# EAGLE design muralizer_3_1 (EAGLE 5.10)
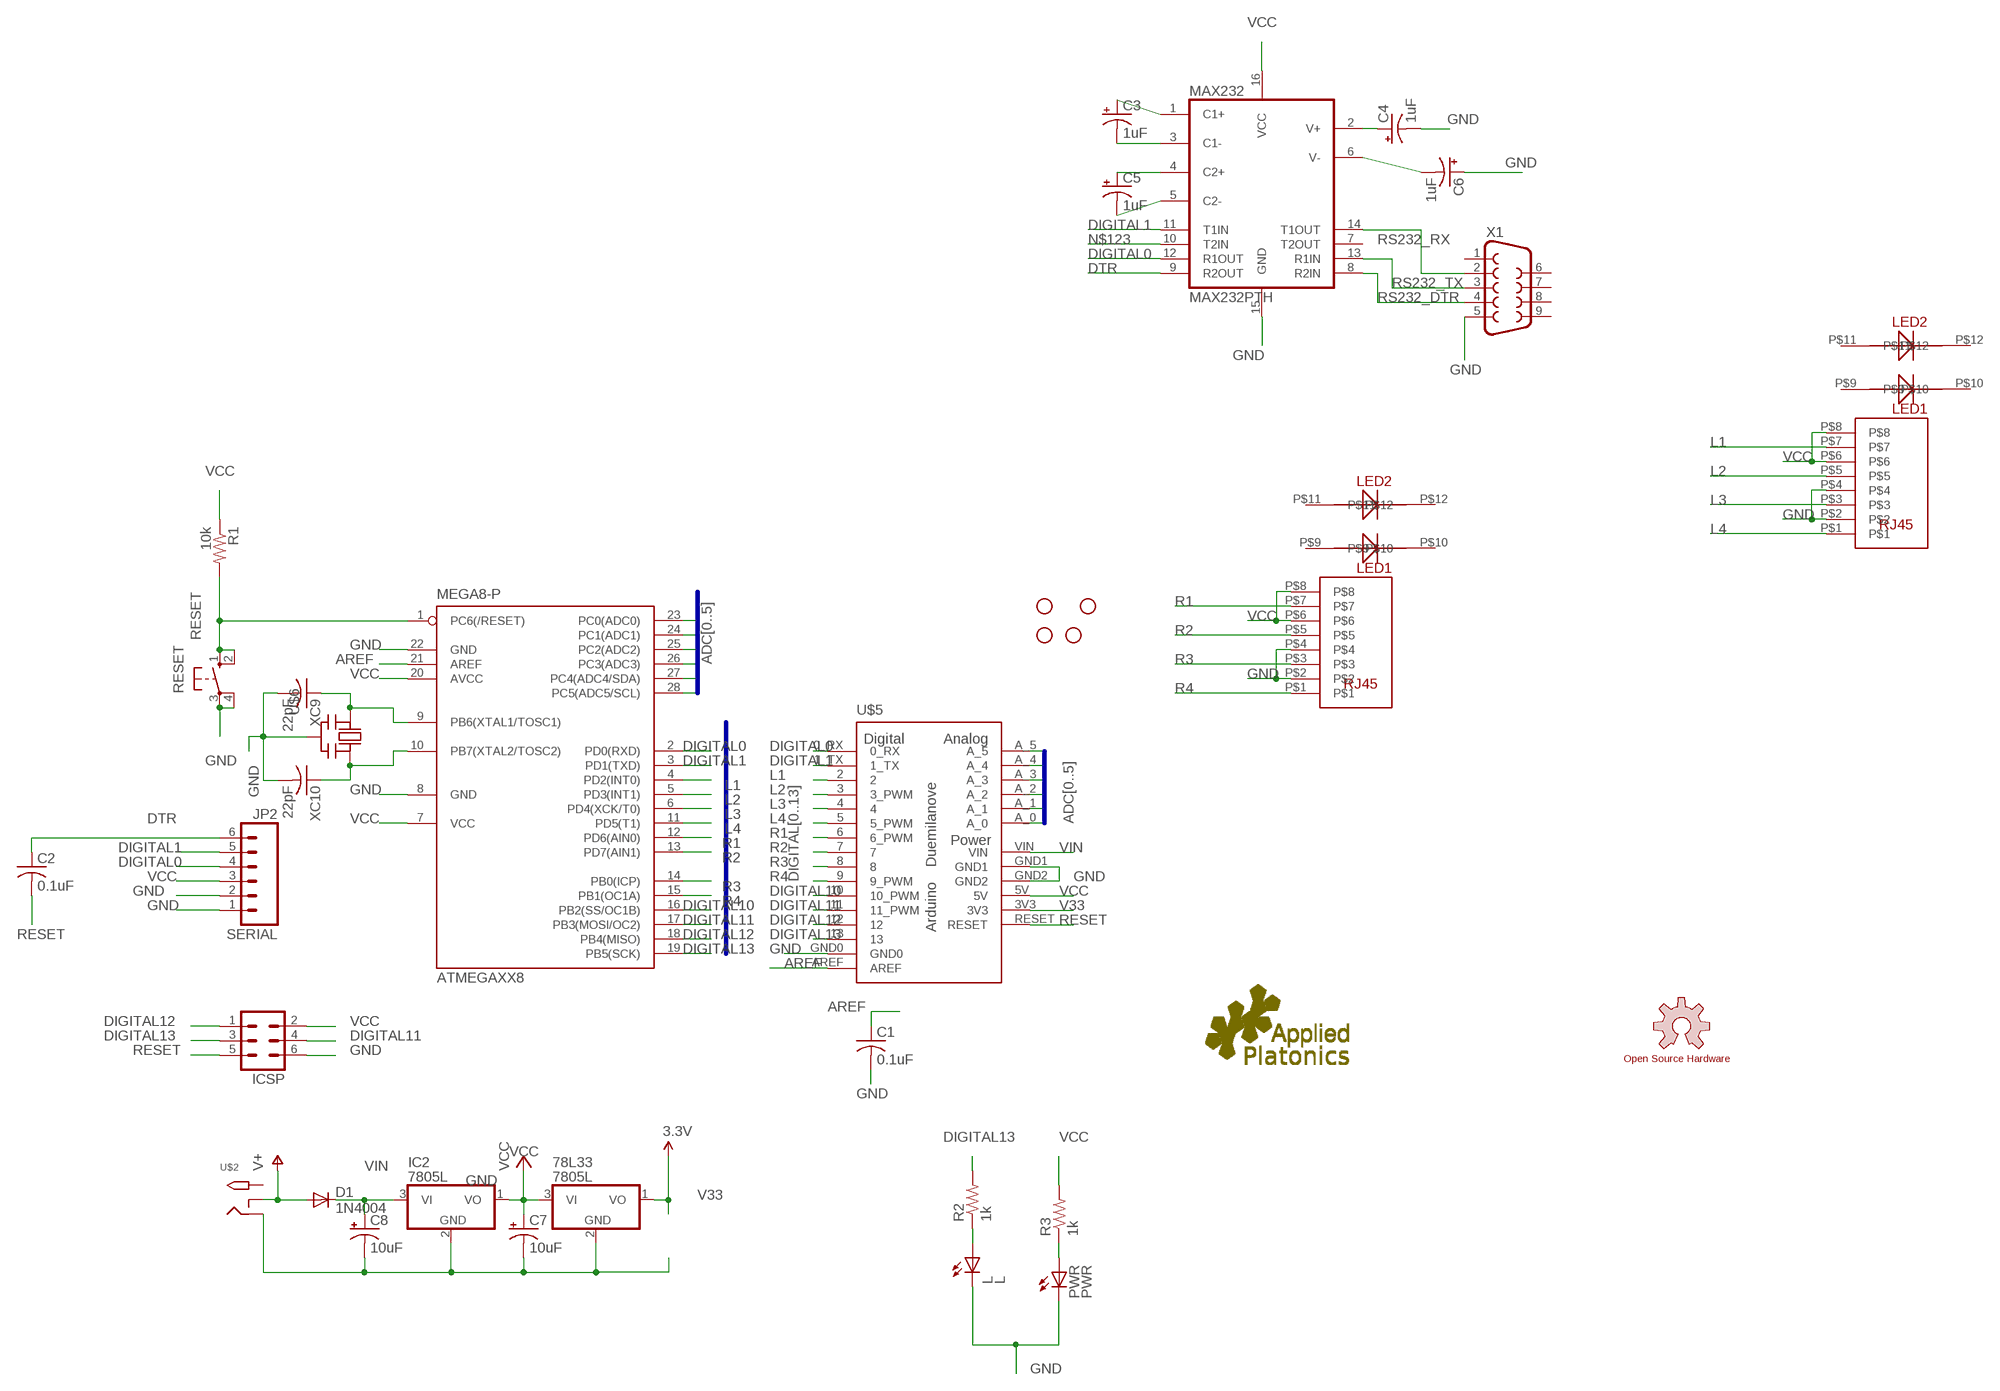
[diagram p0: schematic, sheet 1]

## Parts
78L33  7805L  [TO92]
ATMEGAXX8  MEGA8-P  [DIL28-3]
C1  0.1uF  C-US025-024X044  [C025-024X044]
C2  0.1uF  C-US025-024X044  [C025-024X044]
C3  1uF  CPOL-USE2.5-6  [E2,5-6]
C4  1uF  CPOL-USE2.5-6  [E2,5-6]
C5  1uF  CPOL-USE2.5-6  [E2,5-6]
C6  1uF  CPOL-USE2.5-6  [E2,5-6]
C7  10uF  CPOL-USE2.5-6  [E2,5-6]
C8  10uF  CPOL-USE2.5-6  [E2,5-6]
D1  1N4004  [DO41-10]
IC2  7805L  [TO92]
ICSP  MA03-2  [MA03-2]
JP1  STAND-OFF  [STAND-OFF]
JP2  SERIAL  M06RA  [MOLEX-1X6-RA]
JP3  STAND-OFF  [STAND-OFF]
JP4  STAND-OFF  [STAND-OFF]
JP5  STAND-OFF  [STAND-OFF]
L  L  LED3MM  [LED3MM]
MAX232  MAX232PTH  [DIL16]
PWR  PWR  LED3MM  [LED3MM]
R1  10k  R-US_0204/5  [0204/5]
R2  1k  R-US_0204/5  [0204/5]
R3  1k  R-US_0204/5  [0204/5]
RESET  10-XX  [B3F-10XX]
U$1  RJ45-LEDSAMP-RJHS-UNSHIELDED  [RJ45-AMP-RJHS]
U$2  2.1MMJACK  [PJ-102A]
U$3  AP_LOGO  AP_LOGO8MM  [AP_LOGO_TEENY]
U$4  OSHW_LOGO5MM  [OSHW/5MM]
U$5  ARDUINO-USBNO-OUTLINE-NO-TEXT-OCTAGONAL  [NO-OUTLINE-OCTAGONAL-NOTEXT]
U$6  CERMOSCILL-THM  [CERM_OSC]
U$8  RJ45-LEDSAMP-RJHS-UNSHIELDED  [RJ45-AMP-RJHS]
X1  DB9  [DB9]
XC9  22pF  C-US025-024X044  [C025-024X044]
XC10  22pF  C-US025-024X044  [C025-024X044]

## Nets
ADC0: ATMEGAXX8.23(PC0(ADC0)) U$5.A_0
ADC1: ATMEGAXX8.24(PC1(ADC1)) U$5.A_1
ADC2: ATMEGAXX8.25(PC2(ADC2)) U$5.A_2
ADC3: ATMEGAXX8.26(PC3(ADC3)) U$5.A_3
ADC4: ATMEGAXX8.27(PC4(ADC4/SDA)) U$5.A_4
ADC5: ATMEGAXX8.28(PC5(ADC5/SCL)) U$5.A_5
AREF: ATMEGAXX8.21(AREF) C1.1 U$5.AREF
DIGITAL0: ATMEGAXX8.2(PD0(RXD)) JP2.4 MAX232.12(R1OUT) U$5.0_RX
DIGITAL1: ATMEGAXX8.3(PD1(TXD)) JP2.5 MAX232.11(T1IN) U$5.1_TX
DIGITAL10: ATMEGAXX8.16(PB2(SS/OC1B)) U$5.10(10_PWM)
DIGITAL11: ATMEGAXX8.17(PB3(MOSI/OC2)) ICSP.4 U$5.11(11_PWM)
DIGITAL12: ATMEGAXX8.18(PB4(MISO)) ICSP.1 U$5.12
DIGITAL13: ATMEGAXX8.19(PB5(SCK)) ICSP.3 R2.2 U$5.13
DTR: C2.1 JP2.6 MAX232.9(R2OUT)
GND: 78L33.2(GND) ATMEGAXX8.8(GND) ATMEGAXX8.22(GND) C1.2 C4.- C6.+ C7.- C8.- IC2.2(GND) ICSP.6 JP2.1 JP2.2 L.K(C) MAX232.15(GND) PWR.K(C) RESET.3(P) RESET.4(P1) U$1.P$2 U$1.P$4 U$2.RING U$5.GND0 U$5.GND1 U$5.GND2 U$6.P$2(GND) U$8.P$2 U$8.P$4 X1.5 XC9.2 XC10.2
L1: ATMEGAXX8.4(PD2(INT0)) U$1.P$7 U$5.2
L2: ATMEGAXX8.5(PD3(INT1)) U$1.P$5 U$5.3(3_PWM)
L3: ATMEGAXX8.6(PD4(XCK/T0)) U$1.P$3 U$5.4
L4: ATMEGAXX8.11(PD5(T1)) U$1.P$1 U$5.5(5_PWM)
N$1: ATMEGAXX8.9(PB6(XTAL1/TOSC1)) U$6.P$1(IN) XC9.1
N$2: L.A R2.1
N$3: ATMEGAXX8.10(PB7(XTAL2/TOSC2)) U$6.P$3(OUT) XC10.1
N$4: C4.+ MAX232.2(V+)
N$5: C6.- MAX232.6(V-)
N$6: PWR.A R3.1
N$7: C5.+ MAX232.4(C2+)
N$8: C5.- MAX232.5(C2-)
N$9: C3.+ MAX232.1(C1+)
N$10: C3.- MAX232.3(C1-)
N$123: MAX232.10(T2IN)
R1: ATMEGAXX8.12(PD6(AIN0)) U$5.6(6_PWM) U$8.P$7
R2: ATMEGAXX8.13(PD7(AIN1)) U$5.7 U$8.P$5
R3: ATMEGAXX8.14(PB0(ICP)) U$5.8 U$8.P$3
R4: ATMEGAXX8.15(PB1(OC1A)) U$5.9(9_PWM) U$8.P$1
RESET: ATMEGAXX8.1(PC6(/RESET)) C2.2 ICSP.5 R1.2 RESET.1(S) RESET.2(S1) U$5.RESET
RS232_DTR: MAX232.8(R2IN) X1.4
RS232_RX: MAX232.14(T1OUT) X1.2
RS232_TX: MAX232.13(R1IN) X1.3
V33: 78L33.1(VO) U$5.3V3 ; supply symbol labelled 3.3V
V+: D1.A U$2.RING_SW
VCC: 78L33.3(VI) ATMEGAXX8.7(VCC) ATMEGAXX8.20(AVCC) C7.+ IC2.1(VO) ICSP.2 JP2.3 MAX232.16(VCC) R1.1 R3.2 U$1.P$6 U$1.P$8 U$5.5V U$8.P$6 U$8.P$8
VIN: C8.+ D1.C IC2.3(VI) U$5.VIN
Unconnected: MAX232.7(T2OUT) U$1.P$9 U$1.P$10 U$1.P$11 U$1.P$12 U$2.TIP U$8.P$9 U$8.P$10 U$8.P$11 U$8.P$12 X1.1 X1.6 X1.7 X1.8 X1.9

## Buses
ADC[0..5]
DIGITAL[0..13]

## Library data of the parts
78L33 IC2 = adafruit:78*: Positive VOLTAGE REGULATOR Added bigger pads to the TO-92 package
ATMEGAXX8 = atmel:MEGA8-P: MICROCONTROLLER 8 Kbytes FLASH, 1 kbytes SRAM, 512 bytes EEPROM, USART, 4-channel 10 bit ADC, 2-channel 8 bit ADC Pin compatible with Atmega48, ATMega88, ATMega168 Source: avr.lbr
C1 C2 XC9 XC10 = adafruit:C-US: CAPACITOR, American symbol
C3-C8 = adafruit:CPOL-US: POLARIZED CAPACITOR, American symbol
D1 = adafruit:1N4004: DIODE General purpose 1N400x type rectifier (With bigger pads) http://www.ladyada.net/library/pcb/eaglelibrary.html
ICSP = con-lstb:MA03-2: PIN HEADER
JP1 JP3-JP5 = SparkFun:STAND-OFF: Stand Off This is the mechanical footprint for a #4 phillips button head screw. Use the keepout ring to avoid running the screw head into surrounding components. SKU : PRT-00447
JP2 = SparkFun:M06: Header 6 Standard 6-pin 0.1" header. Use with straight break away headers (SKU : PRT-00116), right angle break away headers (PRT-00553), swiss pins (PRT-00743), machine pins (PRT-00117), and female headers (PRT-00115). Molex polarized connector foot print use with SKU : PRT-08094 with associated crimp pins and housings. NOTES ON THE VARIANTS LOCK and LOCK_LONGPADS... This footprint was designed to help hold the alignment of a through-hole component (i.e. 6-pin header) while soldering it into place. You may notice that each hole has been shifted either up or down by 0.005 of an inch from it's more standard position (which is a perfectly straight line). This slight alteration caused the pins (the squares in the middle) to touch the edges of the holes. Because they are alternating, it causes a "brace" to hold the component in place. 0.005 has proven to be the perfect amount of "off-center" position when using our standard breakaway headers. Although looks a little odd when you look at the bare footprint, once you have a header in there, the alteration is very hard to notice. Also, if you push a header all the way into place, it is covered up entirely on the bottom side. This idea of altering the position of holes to aid alignment will be further integrated into the Sparkfun Library for other footprints. It can help hold any component with 3 or more connection pins.
L PWR = adafruit:LED: LED OSRAM: - CHIPLED LG R971, LG N971, LY N971, LG Q971, LY Q971, LO R971, LY R971 LH N974, LH R974 LS Q976, LO Q976, LY Q976 LO Q996 - Hyper CHIPLED LW Q18S LB Q993, LB Q99A, LB R99A - SideLED LS A670, LO A670, LY A670, LG A670, LP A670 LB A673, LV A673, LT A673, LW A673 LH A674 LY A675 LS A676, LA A676, LO A676, LY A676, LW A676 LS A679, LY A679, LG A679 - Hyper Micro SIDELED® LS Y876, LA Y876, LO Y876, LY Y876 LT Y87S - SmartLED LW L88C, LW L88S LB L89C, LB L89S, LG L890 LS L89K, LO L89K, LY L89K LS L896, LA L896, LO L896, LY L896 - TOPLED LS T670, LO T670, LY T670, LG T670, LP T670 LSG T670, LSP T670, LSY T670, LOP T670, LYG T670 LG T671, LOG T671, LSG T671 LB T673, LV T673, LT T673, LW T673 LH T674 LS T676, LA T676, LO T676, LY T676, LB T676, LH T676, LSB T676, LW T676 LB T67C, LV T67C, LT T67C, LS T67K, LO T67K, LY T67K, LW E67C LS E67B, LA E67B, LO E67B, LY E67B, LB E67C, LV E67C, LT E67C LW T67C LS T679, LY T679, LG T679 LS T770, LO T770, LY T770, LG T770, LP T770 LB T773, LV T773, LT T773, LW T773 LH T774 LS E675, LA E675, LY E675, LS T675 LS T776, LA T776, LO T776, LY T776, LB T776 LHGB T686 LT T68C, LB T68C - Hyper Mini TOPLED® LB M676 - Mini TOPLED Santana® LG M470 LS M47K, LO M47K, LY M47K Source: http://www.osram.convergy.de/
MAX232 = SparkFun:MAX232: RS232 Transceiver Very common IC. This is generically called 'MAX232', but works with the 3V equivalent MAX3232 generic ICs. Field tested and mother approved. Spark Fun Electronics SKU : COM-00316 (DIP) and COM-00589 (SMD)
R1 = resistor:R-US_: RESISTOR, American symbol
R2 R3 = adafruit:R-US_: RESISTOR, American symbol
RESET = switch-omron:10-XX: OMRON SWITCH
U$1 U$8 = AppliedPlatonics:RJ45-LEDS
U$2 = adafruit:2.1MMJACK: 2.1mm x 5.5mm DC jack with internal switch. Digikey part #PJ-102A, 4UCON part #05537 By microbuilder.eu
U$3 = jbm:AP_LOGO
U$4 = AppliedPlatonics:OSHW_LOGO
U$5 = Arduino-Various:ARDUINO-USB: The Ardiuno Duemilanove Pinouts layoutet as a Bare Shield. v0.5 Also for Arduino Diecimila. This is designed as a Part and has no Outline in the Dimension Layer. The Outline, when present, is drawed at the tPlace / bPlace Layer. Library by Stephanie Lange, http://www.k-ita.de/~sl/
U$6 = adafruit:CERMOSCILL: Ceramic oscillator with built in capacitors such as ZTT-12MHz http://www.ladyada.net/library/eagle
X1 = SparkFun:DB9: DB9 Connector Standard DB9 (D-Sub 9) serial connector. Can be used for CAN bus as well as RS485 and RS232. Footprint production proven. Spark Fun Electronics SKU : PRT-00429

## Board
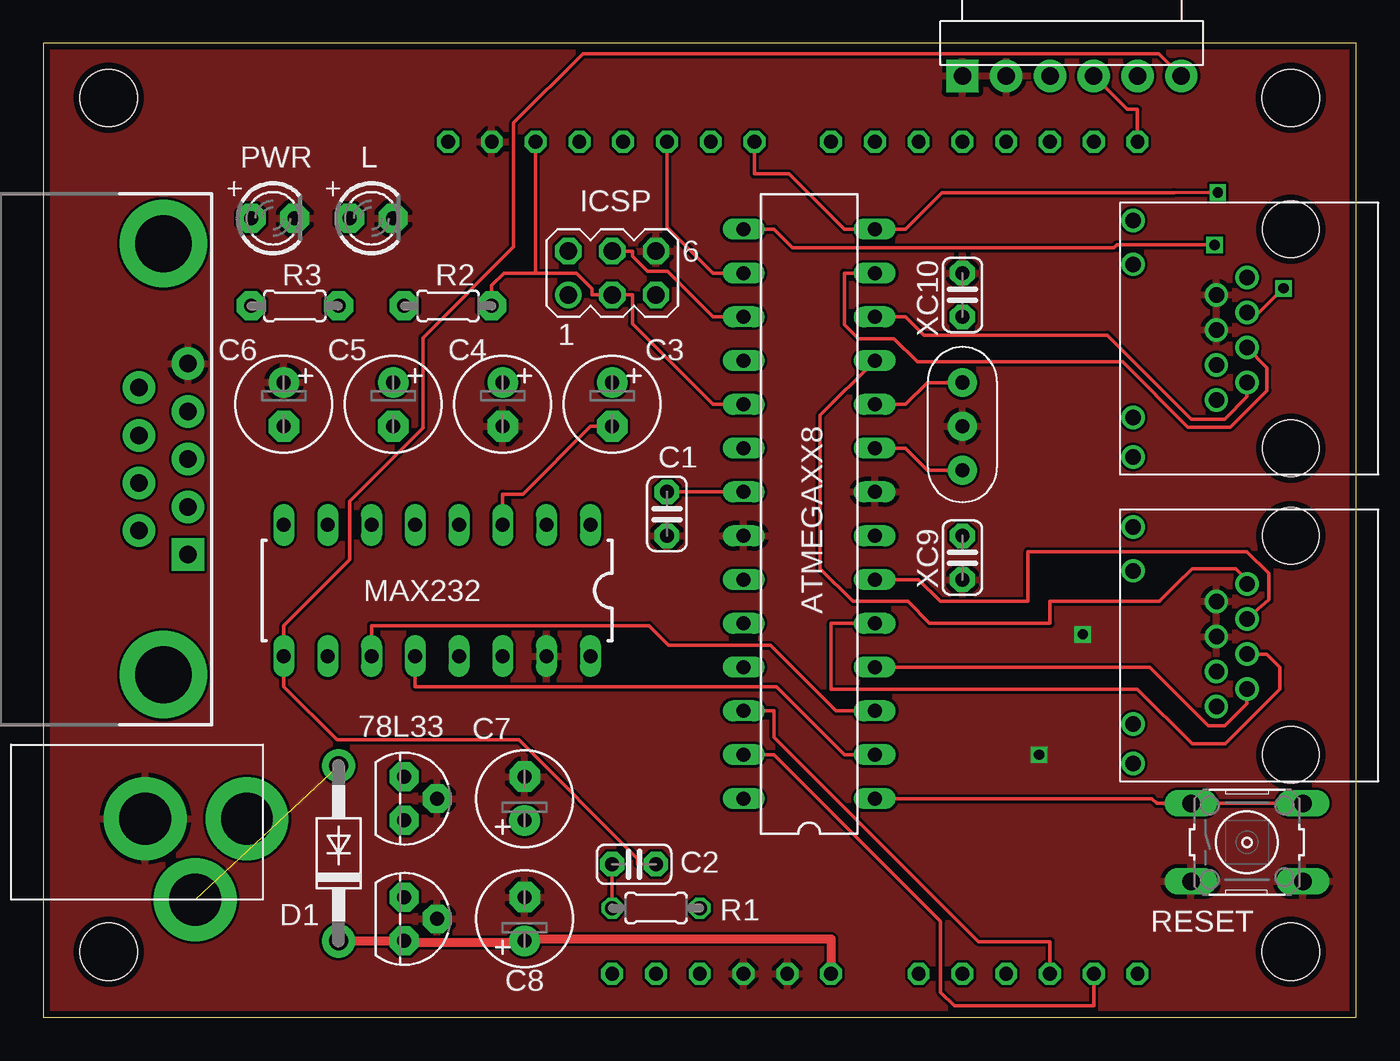
[diagram p1: board, top side]
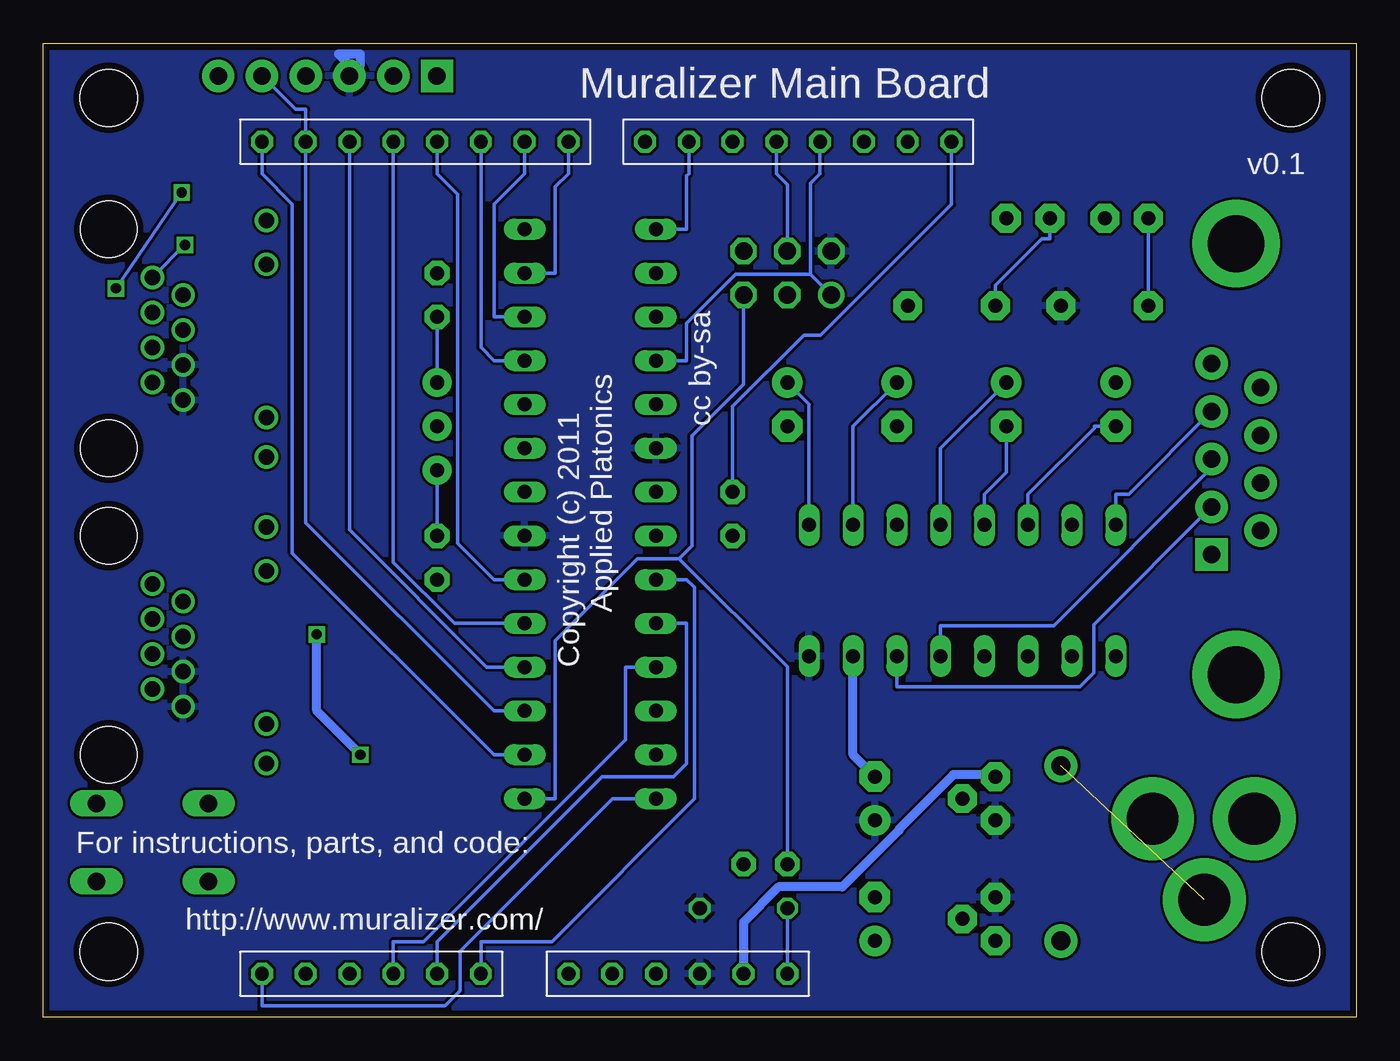
[diagram p2: board, bottom side, seen from below]

Size 76.2 x 56.52 mm. Coordinates in mm from the lower left corner, seen from the top.
Outline: 0,0 76.2,0 76.2,56.52 0,56.52 0,0
Copper layers (1*16): Top 0.0356mm / dielectric 1.5011mm / Bottom 0.0356mm
Design rules "LaenPCBOrder": minimum track width 6mil, minimum drill 13mil, track to track 6mil, track to pad 6mil, pad to pad 6mil, via to via 6mil, smd to smd 6mil, copper to edge 15mil, drill to drill 6mil, minimum pad ring 7mil, minimum via ring 7mil, stop-mask expansion 4mil, vias tented up to drill 0mil, thermal gap 10mil

### Footprints (pad centres in the part's own frame; a part is rotated, then mirrored left to right if it is on the bottom)
TO92 = drill 0.813 pad 1.676 octagon: 1 -1.27,0; 2 0,1.905; 3 1.27,0
DIL28-3 = drill 0.813 long: 1 -16.51,-3.81; 2 -13.97,-3.81; 3 -11.43,-3.81; 4 -8.89,-3.81; 5 -6.35,-3.81; 6 -3.81,-3.81; 7 -1.27,-3.81; 8 1.27,-3.81; 9 3.81,-3.81; 10 6.35,-3.81; 11 8.89,-3.81; 12 11.43,-3.81; 13 13.97,-3.81; 14 16.51,-3.81; 15 16.51,3.81; 16 13.97,3.81; 17 11.43,3.81; 18 8.89,3.81; 19 6.35,3.81; 20 3.81,3.81; 21 1.27,3.81; 22 -1.27,3.81; 23 -3.81,3.81; 24 -6.35,3.81; 25 -8.89,3.81; 26 -11.43,3.81; 27 -13.97,3.81; 28 -16.51,3.81
C025-024X044 = drill 0.813 pad 1.422 octagon: 1 -1.27,0; 2 1.27,0
E2,5-6 = drill 0.813 pad 1.778 round: + -1.27,0 | drill 0.813 pad 1.778 octagon: - 1.27,0
DO41-10 = drill 1.118 pad 1.93 round: A 5.08,0; C -5.08,0
MA03-2 = drill 1.016 round: 1 -2.54,-1.27 | drill 1.016 octagon: 2 -2.54,1.27; 3 0,-1.27; 4 0,1.27; 5 2.54,-1.27; 6 2.54,1.27
STAND-OFF = hole 3.302: 0,0
MOLEX-1X6-RA = drill 1.016 pad 1.88 square: 1 0,0 | drill 1.016 pad 1.88 round: 2 2.54,0; 3 5.08,0; 4 7.62,0; 5 10.16,0; 6 12.7,0
LED3MM = drill 0.813 pad 1.676 octagon: A -1.27,0; K 1.27,0
DIL16 = drill 0.813 long: 1 -8.89,-3.81; 2 -6.35,-3.81; 3 -3.81,-3.81; 4 -1.27,-3.81; 5 1.27,-3.81; 6 3.81,-3.81; 7 6.35,-3.81; 8 8.89,-3.81; 9 8.89,3.81; 10 6.35,3.81; 11 3.81,3.81; 12 1.27,3.81; 13 -1.27,3.81; 14 -3.81,3.81; 15 -6.35,3.81; 16 -8.89,3.81
0204/5 = drill 0.813 octagon: 1 -2.54,0; 2 2.54,0
0204/5' = drill 0.813 pad 1.676 octagon: 1 -2.54,0; 2 2.54,0
B3F-10XX = drill 1.016 long: 1 -3.251,2.261; 2 3.251,2.261; 3 -3.251,-2.261; 4 3.251,-2.261
RJ45-AMP-RJHS = drill 0.9 round: P$1 3.556,2.54; P$2 2.54,4.318; P$3 1.524,2.54; P$4 0.508,4.318; P$5 -0.508,2.54; P$6 -1.524,4.318; P$7 -2.54,2.54; P$8 -3.556,4.318; P$9 6.858,9.144; P$10 4.318,9.144; P$11 -4.572,9.144; P$12 -6.858,9.144 | hole 3.251: -6.35,0; 6.35,0
PJ-102A = drill 3 pad 4.8 round: RING 0.1,-3.39; RING_SW -4.6,-6.29; TIP 0.1,-9.29
NO-OUTLINE-OCTAGONAL-NOTEXT = drill 0.8 pad 1.27 octagon: 0_RX -25.4,27.94; 1_TX -25.4,25.4; 2 -25.4,22.86; 3 -25.4,20.32; 3V3 22.86,0; 4 -25.4,17.78; 5 -25.4,15.24; 5V 22.86,2.54; 6 -25.4,12.7; 7 -25.4,10.16; 8 -25.4,5.715; 9 -25.4,3.175; 10 -25.4,0.635; 11 -25.4,-1.905; 12 -25.4,-4.445; 13 -25.4,-6.985; A_0 22.86,15.24; A_1 22.86,17.78; A_2 22.86,20.32; A_3 22.86,22.86; A_4 22.86,25.4; A_5 22.86,27.94; AREF -25.4,-12.065; GND0 -25.4,-9.525; GND1 22.86,7.62; GND2 22.86,5.08; RESET 22.86,-2.54; VIN 22.86,10.16
CERM_OSC = drill 0.813 pad 1.676 round: P$1 -2.54,0; P$2 0,0; P$3 2.54,0
DB9 = drill 1.016 pad 1.88 square: 1 -5.54,-1.42 | drill 1.016 pad 1.88 round: 2 -2.77,-1.42; 3 0,-1.42; 4 2.77,-1.42; 5 5.54,-1.42; 6 -4.15,1.42; 7 -1.38,1.42; 8 1.38,1.42; 9 4.15,1.42 | drill 3.302 pad 5.08 round: G1 -12.5,0; G2 12.5,0

### Placement (x,y rotation side)
78L33  20.95,12.7 270 top
ATMEGAXX8  44.45,29.21 90 top
C1  36.2,29.21 270 top
C2  34.29,8.89 180 top
C3  33.02,35.56 270 top
C4  26.67,35.56 270 top
C5  20.32,35.56 270 top
C6  13.97,35.56 270 top
C7  27.94,12.7 90 top
C8  27.94,5.71 90 top
D1  17.14,9.53 90 top
IC2  20.95,5.71 270 top
ICSP  33.02,43.18 0 top
JP1  72.39,3.81 0 top
JP2  53.34,54.61 0 top
JP3  3.81,53.34 0 top
JP4  72.39,53.34 0 top
JP5  3.81,3.81 0 top
L  19.05,46.35 0 top
MAX232  22.86,24.77 180 top
PWR  13.34,46.35 0 top
R1  35.56,6.35 180 top
R2  1k  [0204/5']  23.5,41.27 0 top
R3  1k  [0204/5']  14.61,41.27 0 top
RESET  69.85,10.16 0 top
U$1  72.39,21.59 90 top
U$2  2.54,11.43 90 top
U$3  53.34,5.71 0 top
U$4  12.7,2.54 0 top
U$5  35.56,25.4 270 top
U$6  53.34,34.29 90 top
U$8  72.39,39.37 90 top
X1  6.99,32.38 90 top
XC9  53.34,26.67 270 top
XC10  53.34,41.91 90 top

### Tracks (layer width: path | path; a pad name or v marks a point on that pad's centre or on a via)
ADC0
  Bottom 0.203: ATMEGAXX8.23 38.86,25.4 38.4,24.94 38.4,12.68 46.68,4.41 50.8,4.41 U$5.A_0
ADC1
  Bottom 0.203: ATMEGAXX8.24 38.86,22.86 38.86,14.73 39.62,13.97 43.77,13.97 53.34,4.41 U$5.A_1
ADC2
  Bottom 0.203: ATMEGAXX8.25 42.42,20.32 42.42,16.11 54.12,4.41 55.88,4.41 U$5.A_2
ADC3
  Top 0.203: ATMEGAXX8.26 42.42,17.78 42.42,16.24 54.26,4.41 58.42,4.41 U$5.A_3
ADC4
  Top 0.203: ATMEGAXX8.27 42.42,15.24 52.07,5.59 52.07,1.47 52.87,0.68 60.96,0.68 U$5.A_4
ADC5
  Bottom 0.203: U$5.A_5 63.5,0.68 52.87,0.68 52,1.54 52,3.85 43.16,12.7 ATMEGAXX8.28
AREF
  Top 0.203: C1.1 ATMEGAXX8.21
  Bottom 0.203: U$5.AREF 23.5,47.17 31.09,39.57 32.06,39.57 36.2,35.44 C1.1
DIGITAL0
  Top 0.203: ATMEGAXX8.2 46.48,15.24 42.55,19.18 21.59,19.18 MAX232.12 | U$5.0_RX 63.5,52.66 62.91,52.66 JP2.4
  Bottom 0.203: ATMEGAXX8.2 50.04,15.24 61.74,26.94 61.74,47.17 63.5,48.94 U$5.0_RX
DIGITAL1
  Top 0.203: MAX232.11 19.05,22.73 35.14,22.73 36.29,21.59 42.2,21.59 46.01,17.78 ATMEGAXX8.3
  Bottom 0.203: JP2.5 61.55,52.66 60.96,52.66 U$5.1_TX 60.96,28.7 50.04,17.78 ATMEGAXX8.3
DIGITAL10
  Top 0.203: ATMEGAXX8.16 38.86,43.18 36.2,45.85 U$5.10
DIGITAL11
  Top 0.203: ATMEGAXX8.17 38.86,40.64 36.22,43.28 35.06,43.28 34.19,44.16 34.19,44.45 ICSP.4
  Bottom 0.203: U$5.11 33.66,48.94 33.02,48.3 ICSP.4
DIGITAL12
  Bottom 0.203: ICSP.1 31.67,43.1 | 31.67,43.1 31.67,48.38 31.11,48.94 U$5.12 | 31.67,43.1 36.03,43.1 38.86,40.27 38.86,38.1 ATMEGAXX8.18
DIGITAL13
  Top 0.203: 28.57,43.18 30.95,43.18 31.85,42.27 31.85,41.91 ICSP.3 34.19,41.91 34.19,40.23 38.86,35.56 ATMEGAXX8.19 | 28.57,43.18 26.75,43.18 26.04,42.47 R2.2 | 28.57,43.18 U$5.13
DTR
  Top 0.203: JP2.6 64.74,55.91 31.33,55.91 27.3,51.88 27.3,44.7 22.04,39.44 22.04,34.2 17.78,29.94 17.78,26.54 13.97,22.73 MAX232.9 13.97,19.18 17.05,16.1 27.62,16.1 34.49,9.22 34.49,8.89 C2.1
GND  (via drill 0.6)
  Bottom 0.508: MAX232.15 29.21,15.24 C7.- | v60.33,22.23 60.33,17.78 v57.78,15.24
  pour Top: 0,59.69 77.47,59.69 77.47,0 0,0
L1
  Top 0.203: ATMEGAXX8.4 64.21,20.32 67.61,16.92 68.56,16.92 69.85,18.21 U$1.P$7
  Bottom 0.203: U$5.2 58.42,28.29 50.45,20.32 ATMEGAXX8.4
L2
  Top 0.203: U$1.P$5 70.99,21.08 71.75,20.32 71.75,19.05 68.58,15.88 66.67,15.88 63.5,19.05 45.72,19.05 45.72,22.86 46.35,22.86 ATMEGAXX8.5
  Bottom 0.203: U$5.3 55.88,26.4 52.34,22.86 ATMEGAXX8.5
L3
  Top 0.203: ATMEGAXX8.6 50.8,25.4 52.07,24.13 57.15,24.13 57.15,27.03 69.85,27.02 71.12,25.76 71.12,24.23 U$1.P$3
  Bottom 0.203: ATMEGAXX8.6 50.04,25.4 52.15,27.51 52.15,47.74 53.34,48.94 U$5.4
L4
  Top 0.203: ATMEGAXX8.11 45.09,34.92 45.09,26.04 46.99,24.13 50.16,24.13 51.44,22.86 58.42,22.86 58.42,24.13 64.77,24.13 65.79,25.15 66.67,26.04 69.22,26.04 69.85,25.4 U$1.P$1
  Bottom 0.203: ATMEGAXX8.11 50.04,38.1 50.8,38.86 U$5.5
N$1
  Top 0.203: ATMEGAXX8.9 50.04,33.02 51.31,31.75 U$6.P$1
  Bottom 0.203: U$6.P$1 XC9.1
N$2
  Bottom 0.203: L.A 17.78,45.16 18.26,45.16 20.95,42.47 R2.1
N$3
  Top 0.203: ATMEGAXX8.10 50.04,35.56 51.31,36.83 U$6.P$3
  Bottom 0.203: U$6.P$3 XC10.1
N$4
  Bottom 0.203: MAX232.2 29.21,34.29 C4.+
N$5
  Bottom 0.203: C6.- 15.21,34.29 15.21,34.19 19.05,30.35 MAX232.6
N$6
  Bottom 0.203: R3.1 PWR.A
N$7
  Bottom 0.203: MAX232.4 24.13,33.02 C5.+
N$8
  Bottom 0.203: MAX232.5 21.59,30.35 20.32,31.62 C5.-
N$9
  Bottom 0.203: MAX232.1 31.75,35.56 C3.+
N$10
  Top 0.203: MAX232.3 26.67,30.35 27.84,30.35 31.77,34.29 C3.-
R1
  Top 0.203: ATMEGAXX8.12 50.04,40.64 51.1,39.57 61.74,39.57 66.61,34.69 68.55,34.69 69.85,35.99 U$8.P$7
  Bottom 0.203: U$5.6 48.26,48.94 50.04,47.16 50.04,40.64 ATMEGAXX8.12
R2
  Top 0.203: ATMEGAXX8.13 46.48,43.18 46.48,40.19 47.3,39.37 49.38,39.37 50.72,38.02 62.64,38.02 66.43,34.24 68.89,34.24 71.01,36.36 71.01,37.7 U$8.P$5
  Bottom 0.203: U$5.7 45.72,48.94 46.48,48.17 46.48,43.18 ATMEGAXX8.13
R3  (via drill 0.6)
  Top 0.203: U$5.8 41.27,48.94 43.27,48.94 46.48,45.72 ATMEGAXX8.14 50.04,45.72 52.16,47.84 65.63,47.84 v68.16,47.85 | U$8.P$3 70.57,40.89 v71.97,42.29
  Bottom 0.203: v68.16,47.85 v71.97,42.29
R4  (via drill 0.6)
  Top 0.203: ATMEGAXX8.15 42.42,45.72 43.49,44.65 62.13,44.65 62.29,44.81 v67.97,44.81
  Bottom 0.203: v67.97,44.81 U$8.P$1 | U$5.9 38.73,48.94 38.86,48.81 38.86,45.72 ATMEGAXX8.15
RESET
  Top 0.203: ATMEGAXX8.1 64.34,12.7 64.62,12.42 RESET.1 RESET.2 | R1.2 C2.2
  Bottom 0.203: ATMEGAXX8.1 46.48,12.7 46.48,21.85 41.72,26.61 39.29,26.61 | 39.29,26.61 38.55,27.35 38.55,33.73 35.56,36.72 ICSP.5 | C2.2 33.02,20.34 39.29,26.61 | U$5.RESET R1.2
RS232_DTR
  Bottom 0.203: MAX232.8 13.97,30.35 13.21,30.35 X1.4
RS232_RX
  Bottom 0.203: MAX232.14 26.67,19.18 16.05,19.18 15.24,19.98 15.24,22.78 X1.2
RS232_TX
  Bottom 0.203: MAX232.13 24.13,22.73 17.56,22.73 8.4,31.89 X1.3
V33
  Bottom 0.508: U$5.3V3 35.56,5.53 33.52,7.57 29.82,7.57 26.54,10.85 26.54,10.92 23.38,14.08 21.07,14.08 78L33.1
V+  (1 unrouted)
VCC
  Bottom 0.508: JP2.3 58.42,55.24 59.05,55.88 57.78,55.88 57.78,55.24 JP2.3
  pour Bottom: 0,59.69 77.47,59.69 77.47,0 0,0
VIN
  Top 0.508: D1.C IC2.3 21.04,4.36 27.86,4.36 C8.+ 28.05,4.56 45.72,4.56 U$5.VIN

### Text on the board
bPlace: Muralizer Main Board | v0.1 | cc by-sa | Applied Platonics | Copyright (c) 2011 | For instructions, parts, and code: | http://www.muralizer.com/